# Altium schematic sheet STM32-PROX_2.SchDoc
size 261 x 179 mm
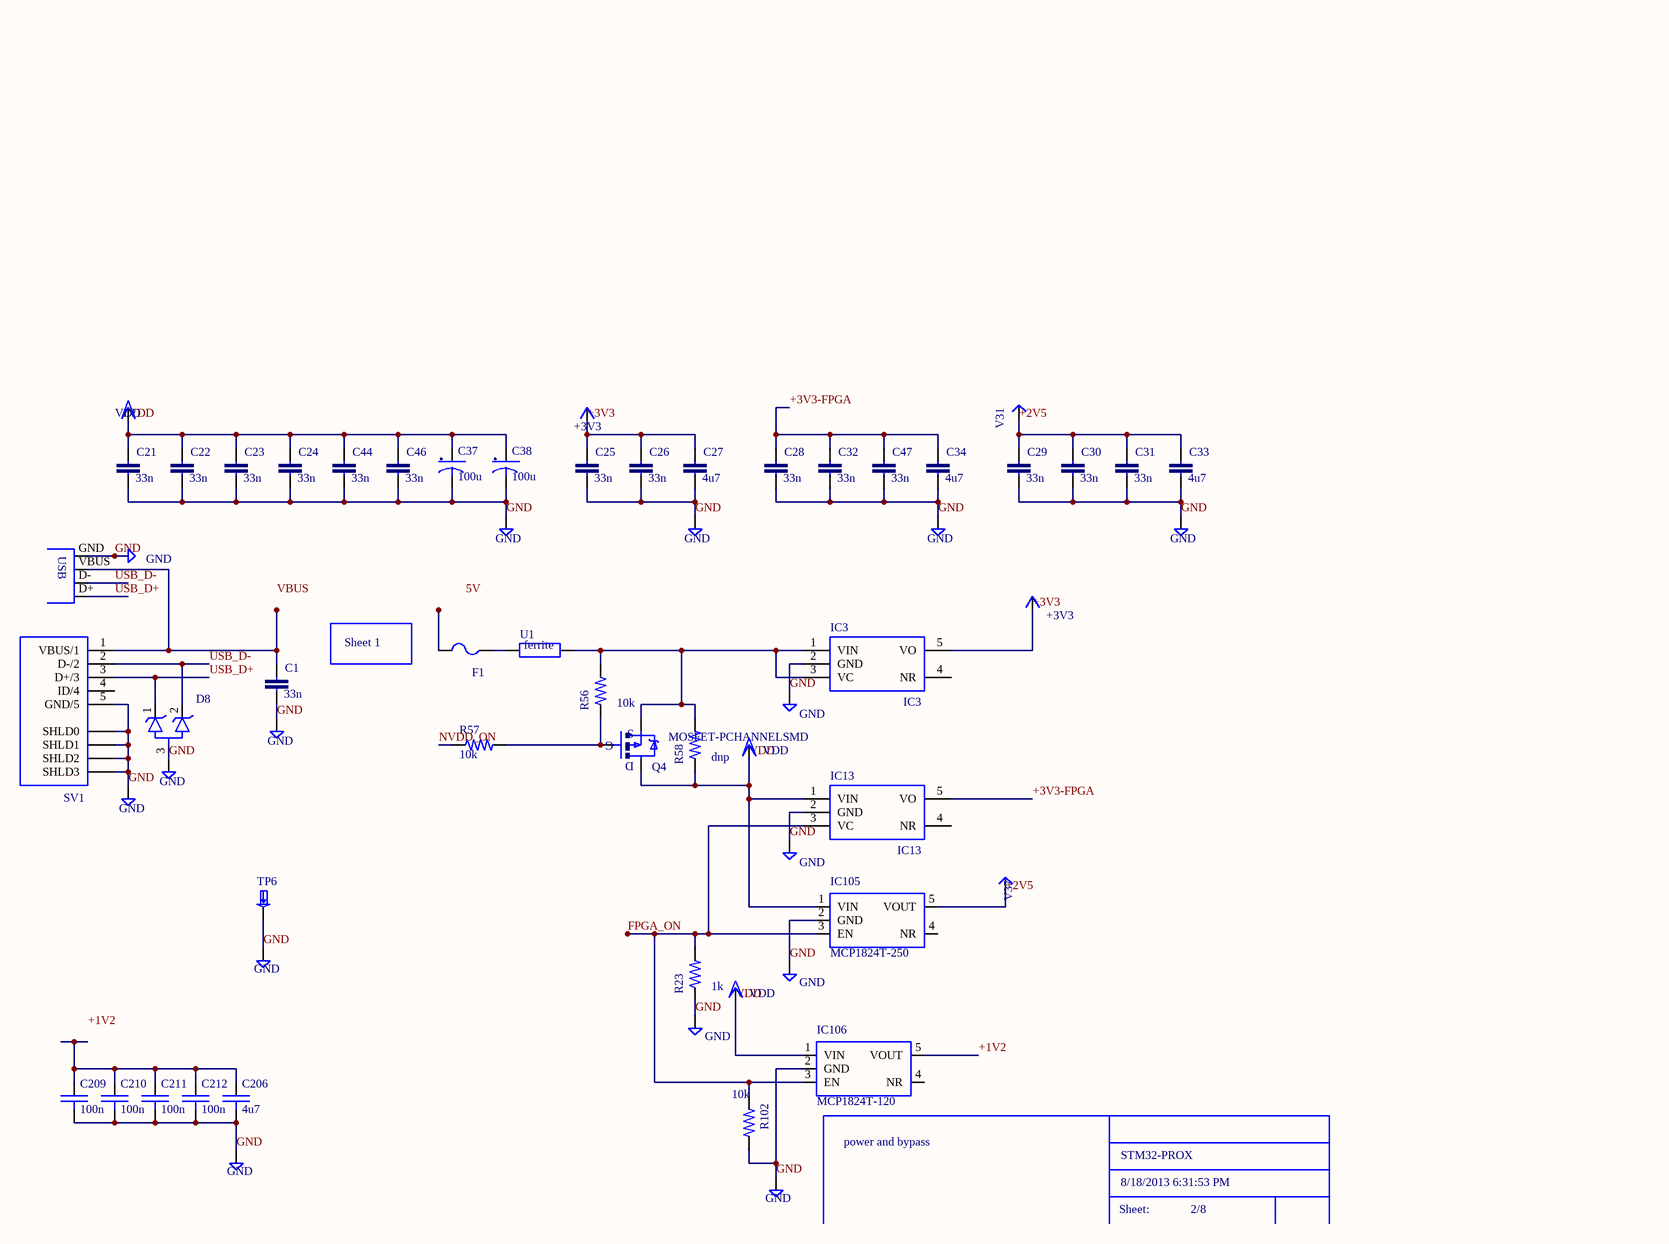
[diagram p0: STM32-PROX_2.SchDoc]

## Parts
C1  33n  [RLC_0603]
C21  33n  [RLC_0603]
C22  33n  [RLC_0603]
C23  33n  [RLC_0603]
C24  33n  [RLC_0603]
C25  33n  [RLC_0603]
C26  33n  [RLC_0603]
C27  4u7  [RLC_1210]
C28  33n  [RLC_0603]
C29  33n  [RLC_0603]
C30  33n  [RLC_0603]
C31  33n  [RLC_0603]
C32  33n  [RLC_0603]
C33  4u7  [RLC_1210]
C34  4u7  [RLC_1210]
C37  100u  [D/7343-31R]
C38  100u  [D/7343-31R]
C44  33n  [RLC_0603]
C46  33n  [RLC_0603]
C47  33n  [RLC_0603]
C206  4u7  [RLC_0603]
C209  100n  [RLC_0603]
C210  100n  [RLC_0603]
C211  100n  [RLC_0603]
C212  100n  [RLC_0603]
D8  (no value)  [SOT23-3LEAD]
F1  (no value)  [1812]
FRAME1  (no value)
IC3  (no value)  [SOT-23-5]
IC13  (no value)  [SOT-23-5]
IC105  MCP1824T-250  [SOT-23-5]
IC106  MCP1824T-120  [SOT-23-5]
Q4  MOSFET-PCHANNELSMD  [SOT23-3]
R23  1k  [RLC_0603]
R56  10k  [RLC_0603]
R57  10k  [RLC_0603]
R58  dnp  [RLC_0603]
R102  10k  [RLC_0603]
SV1  (no value)  [USB-MINIB-SMD]
TP6  (no value)  [KEYSTONE-PTH-TESTPOINT-5011]
U1  (no value)  [RLC_0805]
U$3  +3V3
U$8  +3V3
USB-MICRO  (no value)  [USB-MICROB]
V1  GND
V2  GND
V3  GND
V4  GND
V6  GND
V8  GND
V29  GND
V30  GND
V31  (no value)
V32  GND
V35  GND
V36  GND
V37  (no value)
V38  GND
V39  GND
V51  GND
V54  GND
VDD1  VDD
VDD7  VDD
VDD12  VDD

## Nets
+1V2: IC106.5(VOUT)
+2V5: C29.1 C30.1 C31.1 C33.1 IC105.5(VOUT) V31.0(+2V5) V37.0(+2V5)
+3V3: C25.1 C26.1 C27.1 IC3.5(VO) U$3.0(+3V3) U$8.0(+3V3)
+3V3-FPGA: C28.1 C32.1 C34.1 C47.1 IC13.5(VO)
FPGA_ON: IC13.3(VC) IC105.3(EN) IC106.3(EN) R23.2 R102.1
GND: C1.2 C21.2 C22.2 C23.2 C24.2 C25.2 C26.2 C27.2 C28.2 C29.2 C30.2 C31.2 C32.2 C33.2 C34.2 C37.- C38.- C44.2 C46.2 C47.2 C206.2 C209.2 C210.2 C211.2 C212.2 D8.3(A) IC3.2(GND) IC13.2(GND) IC105.2(GND) IC106.2(GND) R23.1 R102.2 SV1.5(GND/5) SV1.TAB0(SHLD0) SV1.TAB1(SHLD1) SV1.TAB2(SHLD2) SV1.TAB3(SHLD3) TP6.A(P$1) USB-MICRO.GND V1.0(GND) V2.0(GND) V3.0(GND) V4.0(GND) V6.0(GND) V8.0(GND) V29.0(GND) V30.0(GND) V32.0(GND) V35.0(GND) V36.0(GND) V38.0(GND) V39.0(GND) V51.0(GND) V54.0(GND)
NVDD_ON: R57.1
USB_D+: D8.1(K1) SV1.3(D+/3) USB-MICRO.D+
USB_D-: D8.2(K2) SV1.2(D-/2) USB-MICRO.D-
VDD: C21.1 C22.1 C23.1 C24.1 C37.+ C38.+ C44.1 C46.1 IC13.1(VIN) IC105.1(VIN) IC106.1(VIN) Q4.3(D) R58.1 VDD1.0(VDD) VDD7.0(VDD) VDD12.0(VDD)
NetC1_1: C1.1 SV1.1(VBUS/1) USB-MICRO.VBUS
NetC206_1: C206.1 C209.1 C210.1 C211.1 C212.1
NetF1_1: F1.1 U1.1(A)
NetIC3_1: IC3.1(VIN) IC3.3(VC) Q4.2(S) R56.2 R58.2 U1.2(B)
NetQ4_1: Q4.1(G) R56.1 R57.2

Not connected (* = marked no-connect by the designer): F1 2; IC3 4(NR); IC13 4(NR); IC105 4(NR); IC106 4(NR); SV1 4(ID/4)

## Notes on the sheet
- Sheet 1
- power and bypass
- Labels drawn without touching a wire or pin: 5V, +1V2, VBUS
- (in symbol A4L-LOC) STM32-PROX; 8/18/2013 6:31:53 PM; Sheet:; 2/8
- (in symbol FERRITE0805) ferrite
- (in symbol USB-MICROB) USB

## Library data of the parts
C1 C21-C26 C28-C32 C44 C46 C47 = CAPACITORRLC_0603
C27 C33 C34 = CAPACITOR1210
C37 C38 = CPOL-USD/7343-31R
C206 C209-C212 = C-EU
D8 = DUAL-TVS-COMMON-ANODE
F1 = PTCFUSE-1812
FRAME1 = A4L-LOC
IC3 IC13 = PQ1X331M2ZP-3V3-LDO-SOT-23-5
IC105 = TPS79925
IC106 = TPS79912
R23 R56-R58 R102 = RESISTORRLC_0603
SV1 = USB-MINIB
TP6 = TESTPADKEYSTONE-PTH
U1 = FERRITE0805
USB-MICRO = USB-MICROB
V31 V37 = SUPPLY_2V5